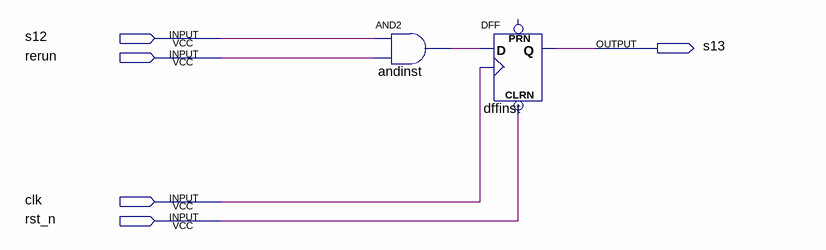
[diagram p0: schematic sheet]
// Quartus schematic s13.bdf as structural Verilog: 2 symbols, 5 pins
module s13 (
  input  s12,
  input  rerun,
  input  clk,
  input  rst_n,
  output s13
);

  wire andinst_out;

  and andinst (andinst_out, s12, rerun);
  DFF dffinst (.CLRN(rst_n), .CLK(clk), .D(andinst_out), .Q(s13));  // open: PRN
endmodule
